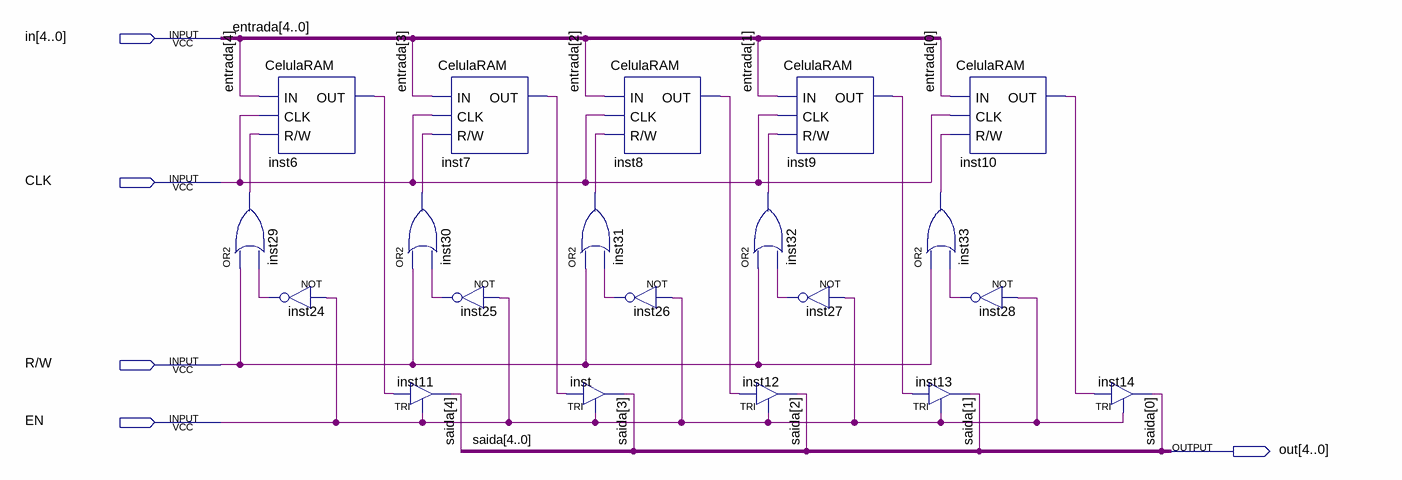
[diagram p0: schematic sheet]
// Quartus schematic LinhaDeRAM.bdf as structural Verilog: 20 symbols, 5 pins
module LinhaDeRAM (
  input  [4:0] in,
  input  CLK,
  input  \R/W ,
  input  EN,
  output [4:0] out
);

  wire inst6_out, inst7_out, inst8_out, inst9_out, inst10_out, inst24_out, inst25_out, inst26_out,
       inst27_out, inst28_out, inst29_out, inst30_out, inst31_out, inst32_out, inst33_out;

  CelulaRAM inst6 (.IN(in[4]), .CLK(CLK), .\R/W (inst29_out), .OUT(inst6_out));
  or inst29 (inst29_out, \R/W , inst24_out);
  not inst24 (inst24_out, EN);
  or inst30 (inst30_out, \R/W , inst25_out);
  TRI inst11 (.IN(inst6_out), .OE(EN), .OUT(out[4]));
  CelulaRAM inst7 (.IN(in[3]), .CLK(CLK), .\R/W (inst30_out), .OUT(inst7_out));
  not inst25 (inst25_out, EN);
  or inst31 (inst31_out, \R/W , inst26_out);
  TRI inst (.IN(inst7_out), .OE(EN), .OUT(out[3]));
  CelulaRAM inst8 (.IN(in[2]), .CLK(CLK), .\R/W (inst31_out), .OUT(inst8_out));
  not inst26 (inst26_out, EN);
  CelulaRAM inst9 (.IN(in[1]), .CLK(CLK), .\R/W (inst32_out), .OUT(inst9_out));
  or inst32 (inst32_out, \R/W , inst27_out);
  not inst27 (inst27_out, EN);
  TRI inst12 (.IN(inst8_out), .OE(EN), .OUT(out[2]));
  CelulaRAM inst10 (.IN(in[0]), .CLK(CLK), .\R/W (inst33_out), .OUT(inst10_out));
  or inst33 (inst33_out, \R/W , inst28_out);
  not inst28 (inst28_out, EN);
  TRI inst13 (.IN(inst9_out), .OE(EN), .OUT(out[1]));
  TRI inst14 (.IN(inst10_out), .OE(EN), .OUT(out[0]));

  // Other names for the same wires on the sheet: entrada[4:0] = in; saida[4:0] = out
endmodule
